# Altium schematic sheet Storage.SchDoc
size A4; SheetNumber: 8; SheetTotal: 10
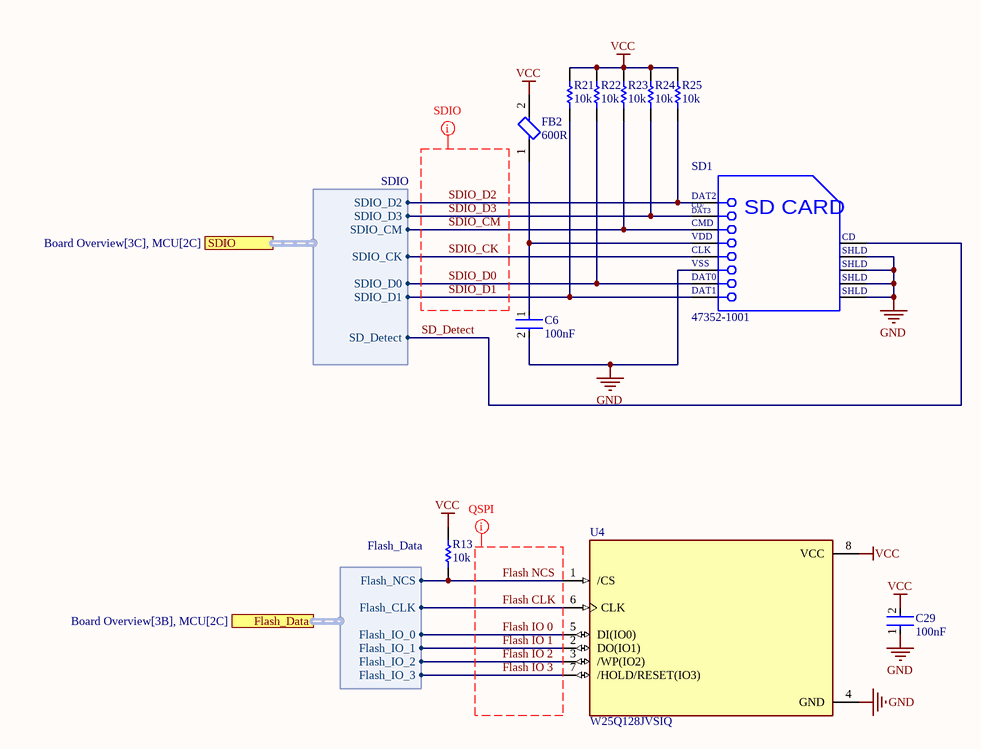
[diagram p0: Storage.SchDoc]

## Parts
C6  value 100nF  [FP-0603-L_1_6_0_15-W_0_81-IPC_C]  (hidden comment: Generic-Capacitor)
C29  value 100nF  [FP-0603-L_1_6_0_15-W_0_81-IPC_C]  (hidden comment: Generic-Capacitor)
FB2  value 600R  [FP-BLM18-0_15-0_1-t0_6-IPC_B]  (hidden comment: GZ1608D601TF)
R13  value 10k  [RESC1609X50X30ML8T20]  (hidden comment: Generic-Resistor)
R21  value 10k  [RESC1609X50X30ML8T20]  (hidden comment: Generic-Resistor)
R22  value 10k  [RESC1609X50X30ML8T20]  (hidden comment: Generic-Resistor)
R23  value 10k  [RESC1609X50X30ML8T20]  (hidden comment: Generic-Resistor)
R24  value 10k  [RESC1609X50X30ML8T20]  (hidden comment: Generic-Resistor)
R25  value 10k  [RESC1609X50X30ML8T20]  (hidden comment: Generic-Resistor)
SD1  47352-1001  [MOLX-473521001_V]
U4  W25Q128JVSIQ  [SOIC127P790X216-8N]

## Ports
Flash_Data (harness Flash_Data, see Board Overview[3B], MCU[2C]), SDIO (harness SDIO, see Board Overview[3C], MCU[2C])

## Harnesses
Flash_Data: Flash_NCS, Flash_CLK, Flash_IO_0, Flash_IO_1, Flash_IO_2, Flash_IO_3
SDIO: SDIO_D2, SDIO_D3, SDIO_CM, SDIO_CK, SDIO_D0, SDIO_D1, SD_Detect

## Nets
GND: C6.2 C29.1 SD1.6(VSS) SD1.10(SHLD) SD1.11(SHLD) SD1.12(SHLD) SD1.13(SHLD) U4.4(GND)
VCC: C29.2 FB2.2 R13.2 R21.2 R22.2 R23.2 R24.2 R25.2 U4.8(VCC)
Flash CLK: U4.6(CLK) ; port Flash_Data.Flash_CLK
Flash IO 0: U4.5(DI(IO0)) ; port Flash_Data.Flash_IO_0
Flash IO 1: U4.2(DO(IO1)) ; port Flash_Data.Flash_IO_1
Flash IO 2: U4.3(/WP(IO2)) ; port Flash_Data.Flash_IO_2
Flash IO 3: U4.7(/HOLD/RESET(IO3)) ; port Flash_Data.Flash_IO_3
Flash NCS: R13.1 U4.1(/CS) ; port Flash_Data.Flash_NCS
SD_Detect: SD1.9(CD) ; port SDIO.SD_Detect
SDIO_CK: SD1.5(CLK) ; port SDIO.SDIO_CK
SDIO_CM: R23.1 SD1.3(CMD) ; port SDIO.SDIO_CM
SDIO_D0: R22.1 SD1.7(DAT0) ; port SDIO.SDIO_D0
SDIO_D1: R21.1 SD1.8(DAT1) ; port SDIO.SDIO_D1
SDIO_D2: R25.1 SD1.1(DAT2) ; port SDIO.SDIO_D2
SDIO_D3: R24.1 SD1.2(CD/DAT3) ; port SDIO.SDIO_D3
NetC6_1: C6.1 FB2.1 SD1.4(VDD)

## Layout directives
mark named QSPI: Flash CLK, Flash IO 0, Flash IO 1, Flash IO 2, Flash IO 3, Flash NCS
mark named SDIO: SDIO_CK, SDIO_CM, SDIO_D0, SDIO_D1, SDIO_D2, SDIO_D3

## Notes on the sheet
- (in symbol CMP-002-00077-1) CD/; DAT3; SD CARD

## Library data of the parts
C6 C29 = CMP-001-00088-6: Generic 0603 Capacitor; Dielectric: X7R; Voltage Rating: 50V; Tolerance: 10%; ESR: 0R; LCSC Part #: C14663; Case Code (Imperial): 0603
FB2 = CMP-006-00021-1: 0603 600Ω ±25% DCR=0.45Ω 0.2A; LCSC PART #: C1002
R13 R21-R25 = CMP-009-00185-4: Generic 0603 Resistor; Power Rating: 100mW; Tolerance: 0%; Voltage Rating: 75V; Case Code (Metric): 1608; Case Code (Imperial): 0603; LCSC Part #: C25804
SD1 = CMP-002-00077-1: Conn Micro SD Card HDR 8 POS 1.1mm Solder RA SMD Embossed T/R 0.5A/Contact; LCSC Part #: C293569
U4 = CMP-040-000000-2: FLASH - NOR Memory IC 128Mb (16M x 8) SPI - Quad I/O, QPI, DTR 133 MHz 8-SOIC; MF: Winbond Electronics; Capacity: 128Mb; Design Item ID: W25Q128JVSIQ; Pin Count: 8; MP: W25Q128JVSIQ; Price: None; Package: SOIC-8 Winbond; LCSC Part #: C97521